# Altium schematic sheet DizCharger_atmega_ardunio_sheild.SchDoc: 18650 Arduino Capacity Tester
size A4; Date: 1-Jun-2020; Author: @ArakniD; CompanyName: HSBNE; DrawnBy: @ArakniD; Engineer: @ArakniD; Organization: 18650-R-US; Revision: 1; SheetNumber: 1; SheetTotal: 1; Time: 1:22 PM
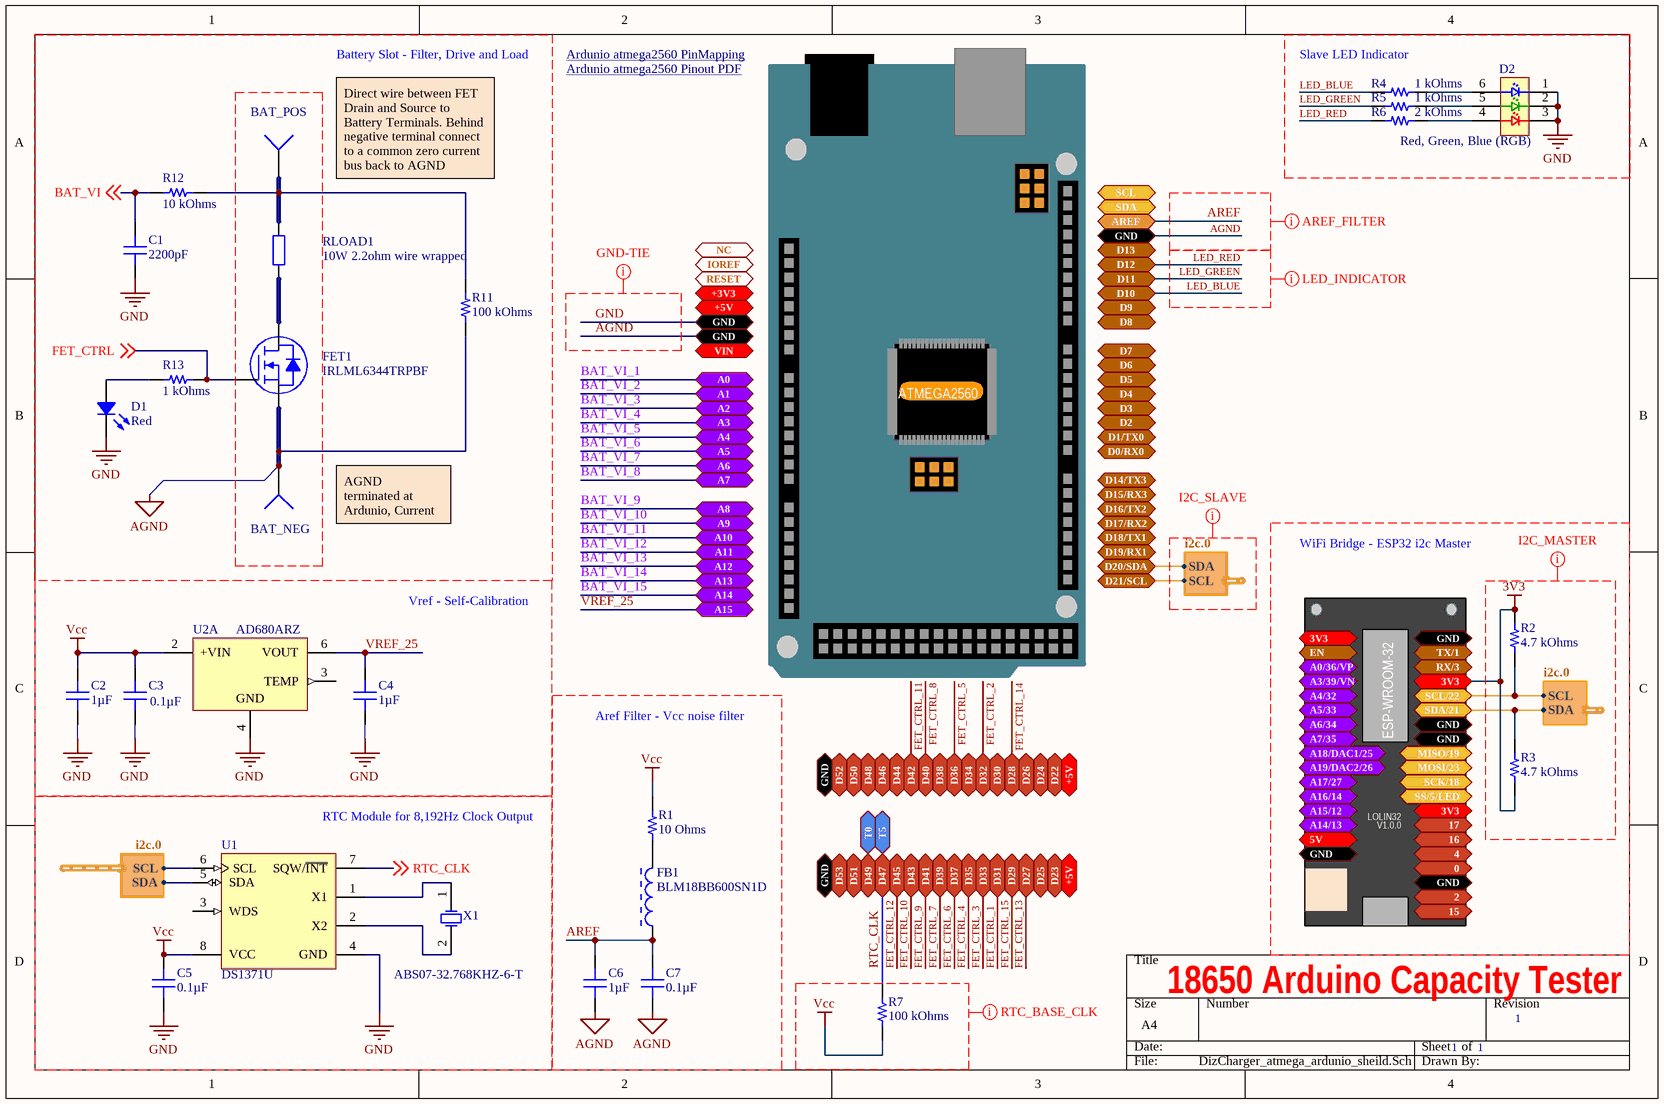
[diagram p0: DizCharger_atmega_ardunio_sheild.SchDoc]

## Parts
BAT_NEG  Socket  [PIN1]  (value not drawn)
BAT_POS  Socket  [PIN1]  (value not drawn)
C1  2200pF  [CAP 0805_2012]
C2  1µF  [CAP 0805_2012]
C3  0.1µF  [CAP 0805_2012]
C4  1µF  [CAP 0805_2012]
C5  0.1µF  [CAP 0805_2012]
C6  1µF  [CAP 0805_2012]
C7  0.1µF  [CAP 0805_2012]
D1  Red  [LED 1206_3216 RED]
D2  Red, Green, Blue (RGB)  [LED PLCC6-CREE 5.5X5.3MM]
FB1  BLM18BB600SN1D  [MURA-BLM18-F-H1-CHIP-2_V]
FET1  IRLML6344TRPBF  [INFINEON SOT-23-3]
R1  10 Ohms  [RES 0805_2012]
R2  4.7 kOhms  [RES 0805_2012]
R3  4.7 kOhms  [RES 0805_2012]
R4  1 kOhms  [RES 0805_2012]
R5  1 kOhms  [RES 0805_2012]
R6  2 kOhms  [RES 0805_2012]
R7  100 kOhms  [RES 0805_2012]
R11  100 kOhms  [RES 0805_2012]
R12  10 kOhms  [RES 0805_2012]
R13  1 kOhms  [RES 0805_2012]
RLOAD1  10W 2.2ohm wire wrapped  [AXIAL-0.4]
U1  DS1371U  [U8-1_L]
U2  AD680ARZ  [ADI-R-8_L]  (part A of 2)
X1  ABS07-32.768KHZ-6-T  [ABRA-ABS07_V]

## Ports
0 (bidir), 2 (bidir), 3V3 (bidir), 4 (bidir), 5V (bidir), 15 (bidir), 16 (bidir), 17 (bidir), +3V3 (bidir), +5V (bidir), A0 (bidir), A0/36/VP (bidir), A1 (bidir), A2 (bidir), A3 (bidir), A3/39/VN (bidir), A4 (bidir), A4/32 (bidir), A5 (bidir), A5/33 (bidir), A6 (bidir), A6/34 (bidir), A7 (bidir), A7/35 (bidir), A8 (bidir), A9 (bidir), A10 (bidir), A11 (bidir), A12 (bidir), A13 (bidir), A14 (bidir), A14/13 (bidir), A15 (bidir), A15/12 (bidir), A16/14 (bidir), A17/27 (bidir), A18/DAC1/25 (bidir), A19/DAC2/26 (bidir), AREF (bidir), D0/RX0 (bidir), D1/TX0 (bidir), D2 (bidir), D3 (bidir), D4 (bidir), D5 (bidir), D6 (bidir), D7 (bidir), D8 (bidir), D9 (bidir), D10 (bidir), D11 (bidir), D12 (bidir), D13 (bidir), D14/TX3 (bidir), D15/RX3 (bidir), D16/TX2 (bidir), D17/RX2 (bidir), D18/TX1 (bidir), D19/RX1 (bidir), D20/SDA (bidir), D21/SCL (bidir), D22 (bidir), D23 (bidir), D24 (bidir), D25 (bidir), D26 (bidir), D27 (bidir), D28 (bidir), D29 (bidir), D30 (bidir), D31 (bidir), D32 (bidir), D33 (bidir), D34 (bidir), D35 (bidir), D36 (bidir), D37 (bidir), D38 (bidir), D39 (bidir), D40 (bidir), D41 (bidir), D42 (bidir), D43 (bidir), D44 (bidir), D45 (bidir), D46 (bidir), D47 (bidir), D48 (bidir), D49 (bidir), D50 (bidir), D51 (bidir), D52 (bidir), D53 (bidir), EN (bidir), GND (bidir), IOREF (bidir), MISO/19 (bidir), MOSI/23 (bidir), NC (bidir), RESET (bidir), RX/3 (bidir), SCK/18 (bidir), SCL (bidir), SCL/22 (bidir), SDA (bidir), SDA/21 (bidir), SS/5/LED (bidir), T0 (bidir), T5 (bidir), TX/1 (bidir), VIN (bidir)

## Harnesses
i2c.0: SDA, SCL

## Nets
3V3: R2.2 R3.1 ; port 3V3
AGND: BAT_NEG.1 C1.1 C2.1 C3.1 C4.1 C5.1 C6.1 C7.1 D1.2 D2.1(C1) D2.2(C2) D2.3(C3) FET1.2(S) R11.1 U1.4(GND) U2.4(GND) ; port GND  [also labelled GND]
Vcc: C2.2 C3.2 C5.2 R1.2 R7.1 U1.8(VCC) U2.2(+VIN)
AREF: C6.2 C7.2 FB1.1 ; port AREF
BAT_VI: C1.2 R12.2 ; off-sheet BAT_VI
BAT_VI_1: port A0
BAT_VI_2: port A1
BAT_VI_3: port A2
BAT_VI_4: port A3
BAT_VI_5: port A4
BAT_VI_6: port A5
BAT_VI_7: port A6
BAT_VI_8: port A7
BAT_VI_9: port A8
BAT_VI_10: port A9
BAT_VI_11: port A10
BAT_VI_12: port A11
BAT_VI_13: port A12
BAT_VI_14: port A13
BAT_VI_15: port A14
D20/SDA: port D20/SDA, harness i2c.0.SDA
D21/SCL: port D21/SCL, harness i2c.0.SCL
D49: port D49, port T0
FET_CTRL: FET1.1(G) R13.1 ; off-sheet FET_CTRL
FET_CTRL_1: port D31
FET_CTRL_2: port D32
FET_CTRL_3: port D33
FET_CTRL_4: port D35
FET_CTRL_5: port D36
FET_CTRL_6: port D37
FET_CTRL_7: port D39
FET_CTRL_8: port D40
FET_CTRL_9: port D41
FET_CTRL_10: port D43
FET_CTRL_11: port D42
FET_CTRL_12: port D45
FET_CTRL_13: port D27
FET_CTRL_14: port D28
FET_CTRL_15: port D29
LED_BLUE: R4.2 ; port D10
LED_GREEN: R5.2 ; port D11
LED_RED: R6.1 ; port D12
RTC_CLK: R7.2 U1.7(SQW/~{INT}) ; off-sheet RTC_CLK, port D47, port T5
SCL/22: R2.1 ; port SCL/22, harness i2c.0.SCL
SDA/21: R3.2 ; port SDA/21, harness i2c.0.SDA
VREF_25: C4.2 U2.6(VOUT) ; port A15
NetBAT_POS_1: BAT_POS.1 R11.2 R12.1 RLOAD1.2
NetD1_1: D1.1 R13.2
NetD2_4: D2.4(A3) R6.2
NetD2_5: D2.5(A2) R5.1
NetD2_6: D2.6(A1) R4.1
NetFB1_2: FB1.2 R1.1
NetFET1_3: FET1.3(D) RLOAD1.1
NetU1_1: U1.1(X1) X1.1(X1)
NetU1_2: U1.2(X2) X1.2(X2)
NetU1_5: U1.5(SDA) ; harness i2c.0.SDA
NetU1_6: U1.6(SCL) ; harness i2c.0.SCL

Not connected (* = marked no-connect by the designer): U1 3(WDS); U2 3(TEMP)

## Layout directives
mark named GND-TIE: AGND, GND
mark named AREF_FILTER: AGND, AREF
mark named LED_INDICATOR: LED_BLUE, LED_GREEN, LED_RED
mark named I2C_SLAVE: (no net found under the mark)
mark named I2C_MASTER: 3V3
mark named RTC_BASE_CLK: Vcc

## Notes on the sheet
- Battery Slot - Filter, Drive and Load
- Ardunio atmega2560 PinMapping <https://www.arduino.cc/en/Hacking/PinMapping2560>
- Ardunio atmega2560 Pinout PDF <https://content.arduino.cc/assets/Pinout-Mega2560rev3_latest.pdf>
- Slave LED Indicator
- Direct wire between FET Drain and Source to Battery Terminals. Behind negative terminal connect to a common zero current bus back to AGND
- ATMEGA2560
- AGND  terminated at Ardunio, Current flow will induce false voltage/current readings
- WiFi Bridge - ESP32 i2c Master
- Vref - Self-Calibration
- ESP-WROOM-32
- Aref Filter - Vcc noise filter
- (near U1) RTC Module for 8,192Hz Clock Output
- #if defined(__AVR_ATmega1280__)
  { 30,31,32,33, 34,35,36,37, 43,42,45, 38,39,40,41  };
  #elif defined(__AVR_ATmega2560__)
  { 31,32,33, 35,36,37, 39,40,41, 43,42,45, 27,28,29 };
  #endif
- LOLIN32
- V1.0.0

## Library data of the parts
C1 = C0805C222KAGECAUTO: CAP CER 0805 2.2NF 250V C0G; Manufacturer: KEMET; Temperature Coefficient: C0G, NP0; Tolerance: ±10%; Part Number: C0805C222KAGECAUTO; Value: 2200pF; Applications: Automotive, ESD Protection; Capacitance: 2200pF; ComponentLink1Description: Datasheet; ComponentLink1URL: https://api.kemet.com/component-edge/download/datasheet/C0805C222KAGECAUTO.pdf; ComponentLink2Description: DigiKey Link; ComponentLink2URL: http://digikey.com/product-detail/en/kemet/C0805C222KAGECAUTO/399-17905-1-ND/8640572; Device Package: 0805 (2012 Metric); Features: Low ESL; LastUpdated: 21/01/2020 12:02:55 AM; Lifecycle Status: Active; Minimum Order: 1; Mounting Type: Surface Mount, MLCC; Operating Temperature: -55°C ~ 125°C; Package / Case: 0805 (2012 Metric); Packaging: TapeAndReel; PartId: 9908; Part Status: Active; Price: 0.05; Ratings: AEC-Q200; Series: ESD SMD Auto C0G; Size / Dimension: 0.079" L x 0.049" W (2.00mm x 1.25mm); Supplier 1: DigiKey; Supplier Part Number 1: 399-17905-1-ND; Thickness (Max): 0.035" (0.88mm); Voltage - Rated: 250V
C2 C4 C6 = 0805YC105KAZ2A: CAP CER 1UF 16V X7R 0805; Manufacturer: AVX Corporation; Tolerance: ±10%; Part Number: 0805YC105KAZ2A; Value: 1µF; Applications: Boardflex Sensitive; Capacitance: 1µF; ComponentLink1Description: Datasheet; ComponentLink1URL: http://datasheets.avx.com/FlexitermMLCC.pdf; ComponentLink2Description: DigiKey Link; ComponentLink2URL: http://digikey.com/product-detail/en/avx-corporation/0805YC105KAZ2A/478-11646-1-ND/8564204; Device Package: 0805 (2012 Metric); Features: Soft Termination; LastUpdated: 21/01/2020 12:02:58 AM; Lifecycle Status: Active; Minimum Order: 1; Mounting Type: Surface Mount, MLCC; Operating Temperature: -55°C ~ 125°C; Package / Case: 0805 (2012 Metric); Packaging: TapeAndReel; PartId: 7759; Part Status: Active; Price: 0.60; Series: FLEXITERM®; Size / Dimension: 0.079" L x 0.049" W (2.00mm x 1.25mm); Supplier 1: DigiKey; Supplier Part Number 1: 478-11646-1-ND; Temperature Coefficient: X7R; Thickness (Max): 0.037" (0.94mm); Voltage - Rated: 16V
C3 C5 C7 = 0805B104K160CT: CAP CER 0.1UF 16V X7R 0805; Manufacturer: Walsin Technology Corporation; Tolerance: ±10%; Part Number: 0805B104K160CT; Value: 0.1µF; Applications: General Purpose; Capacitance: 0.1µF; ComponentLink1Description: Datasheet; ComponentLink1URL: http://www.passivecomponent.com/wp-content/uploads/2018/10/MLCC.pdf; ComponentLink2Description: DigiKey Link; ComponentLink2URL: http://digikey.com/product-detail/en/walsin-technology-corporation/0805B104K160CT/1292-1565-1-ND/9355569; Device Package: 0805 (2012 Metric); LastUpdated: 21/01/2020 12:03:02 AM; Lifecycle Status: Active; Minimum Order: 1; Mounting Type: Surface Mount, MLCC; Operating Temperature: -55°C ~ 125°C; Package / Case: 0805 (2012 Metric); Packaging: TapeAndReel; PartId: 4882; Part Status: Active; Price: 0.02; Series: -; Size / Dimension: 0.079" L x 0.049" W (2.00mm x 1.25mm); Supplier 1: DigiKey; Supplier Part Number 1: 1292-1565-1-ND; Temperature Coefficient: X7R; Thickness (Max): 0.035" (0.90mm); Voltage - Rated: 16V
D1 = APTL3216SURCK-01: LED SMD; Manufacturer: Kingbright; Configuration: 1206; Current - Test: 20mA; Lens Color: Colorless; Lens Size: 1.10mm Dia; Lens Style: Round with Domed Top; Lens Transparency: Clear; Millicandela Rating: 230mcd; Viewing Angle: 80°; Voltage - Forward (Vf) (Typ): 1.95V; Wavelength - Dominant: 630nm; Wavelength - Peak: 645nm; Part Number: APTL3216SURCK-01; Color: Red; ComponentLink1Description: Datasheet; ComponentLink1URL: http://www.kingbrightusa.com/images/catalog/SPEC/APTL3216SURCK-01.pdf; ComponentLink2Description: DigiKey Link; ComponentLink2URL: http://digikey.com/product-detail/en/kingbright/APTL3216SURCK-01/754-APTL3216SURCK-01CT-ND/10293135; Device Package: 1206 (3216 Metric); Height (Max): 1.20mm; LastUpdated: 21/01/2020 3:14:28 AM; Lifecycle Status: Active; Minimum Order: 1; Mounting Type: Surface Mount; Package / Case: 1206 (3216 Metric); Packaging: TapeAndReel; PartId: 229; Part Status: Active; Price: 0.08; Series: Heli-R; Size / Dimension: 3.20mm L x 1.60mm W; Supplier 1: DigiKey; Supplier Part Number 1: 754-APTL3216SURCK-01CT-ND; Supplier Device Package: 1206; Value: Red
D2 = SLV6A-FKB-CK1P1G1BB7R3R3: LED RGB 6PLCC SMD; Manufacturer: Cree Inc.; Configuration: Independent; Current - Test: 20mA Red, 20mA Green, 20mA Blue; Lens Color: 2.60mm; Lens Size: 4.20mm Dia; Lens Style: Round with Flat Top; Millicandela Rating: 840mcd Red, 1680mcd Green, 420mcd Blue; Voltage - Forward (Vf) (Typ): 2V Red, 3.2V Green, 3.2V Blue; Wavelength - Dominant: 622nm Red, 530nm Green, 470nm Blue; Part Number: SLV6A-FKB-CK1P1G1BB7R3R3; Color: Red, Green, Blue (RGB); ComponentLink1Description: Datasheet; ComponentLink1URL: https://www.cree.com/led-components/media/documents/1320-SLV6A-FKB.pdf; ComponentLink2Description: DigiKey Link; ComponentLink2URL: http://digikey.com/product-detail/en/cree-inc/SLV6A-FKB-CK1P1G1BB7R3R3/SLV6A-FKB-CK1P1G1BB7R3R3CT-ND/6138648; Device Package: 6-SMD, J-Lead; Height (Max): 2.60mm; LastUpdated: 19/03/2020 10:22:30 PM; Lifecycle Status: Active; Minimum Order: 1; Mounting Type: Surface Mount; Package / Case: 6-SMD, J-Lead; Packaging: TapeAndReel; PartId: 954; Part Status: Active; Price: 0.33; Series: SLV6A-FKB; Size / Dimension: 5.50mm L x 5.30mm W; Supplier 1: DigiKey; Supplier Part Number 1: SLV6A-FKB-CK1P1G1BB7R3R3CT-ND; Supplier Device Package: 6-PLCC; Value: Red, Green, Blue (RGB)
FB1 = CMP-0686-00415-2: Chip Ferrite Bead for High-speed Signal Lines, 60 Ohm, 550 mA, -55 to 125 degC, 1.6 x 0.8 x 0.95 mm SMD, Tape and Reel; Manufacturer: Murata; DC Resistance: 0.25 Ohm Max.; Impedance (at 100 MHz): 60 Ohm +/- 25%; Rated Current: 550 mA; Operating Temperature Range: -55 to 125 degC; ComponentLink1Description: Manufacturer URL; Packing: Tape and Reel; DatasheetVersion: 08/2013; PackageReference: BLM18_H950-2; ComponentLink3Description: Package Specification; ComponentLink2URL: http://www.murata.com/products/catalog/pdf/c31e.pdf; ComponentLink2Description: Datasheet; Mounting Technology: Surface Mount; ComponentLink1URL: http://www.murata.com/; PartNumber: BLM18BB600SN1D; PackageDescription: 2-Pin Chip, Body 1.6 x 0.8 mm; ComponentLink3URL: http://www.murata.com/products/catalog/pdf/c31e.pdf
FET1 = IRLML6344TRPBF: MOSFET N-CH 30V 5A SOT23; Manufacturer: Infineon Technologies; Current - Continuous Drain (Id) @ 25°C: 5A (Ta); Drive Voltage (Max Rds On,  Min Rds On): 2.5V, 4.5V; FET Type: N-Channel; Gate Charge (Qg) (Max) @ Vgs: 6.8nC @ 4.5V; Input Capacitance (Ciss) (Max) @ Vds: 650pF @ 25V; Power Dissipation (Max): 1.3W (Ta); Rds On (Max) @ Id, Vgs: 29mOhm @ 5A, 4.5V; Vgs (Max): ±12V; Vgs(th) (Max) @ Id: 1.1V @ 10µA; Part Number: IRLML6344TRPBF; ComponentLink1Description: Datasheet; ComponentLink1URL: https://www.infineon.com/dgdl/irlml6344pbf.pdf?fileId=5546d462533600a4015356689c44262c; ComponentLink2Description: DigiKey Link; ComponentLink2URL: http://digikey.com/product-detail/en/infineon-technologies/IRLML6344TRPBF/IRLML6344TRPBFCT-ND/2538168; Device Package: TO-236-3, SC-59, SOT-23-3; Drain to Source Voltage (Vdss): 30V; LastUpdated: 21/01/2020 4:00:48 AM; Lifecycle Status: Active; Minimum Order: 1; Mounting Type: Surface Mount; Operating Temperature: -55°C ~ 150°C (TJ); Package / Case: TO-236-3, SC-59, SOT-23-3; Packaging: TapeAndReel; Part Status: Active; Price: 0.12; Series: HEXFET®; Supplier 1: DigiKey; Supplier Part Number 1: IRLML6344TRPBFCT-ND; Supplier Device Package: Micro3™/SOT-23; Technology: MOSFET (Metal Oxide)
R1 = Y407210R0000C9W: RES SMD 10 OHM 0.25% 1/5W 0805; Manufacturer: Vishay Foil Resistors (Division of Vishay Precision Group); Power (Watts): 0.2W, 1/5W; Temperature Coefficient: ±0.2ppm/°C; Part Number: Y407210R0000C9W; Value: 10 Ohms; ComponentLink1Description: Datasheet; ComponentLink1URL: http://www.vishaypg.com/docs/63237/FRFC.pdf; ComponentLink2Description: DigiKey Link; ComponentLink2URL: http://digikey.com/product-detail/en/vishay-foil-resistors-division-of-vishay-precision-group/Y407210R0000C9W/804-1211-ND/6026412; Composition: Metal Foil; Device Package: 0805 (2012 Metric); Features: Moisture Resistant, Non-Inductive; Height - Seated (Max): 0.025" (0.64mm); LastUpdated: 21/01/2020 1:44:08 AM; Lifecycle Status: Active; Minimum Order: 1; Number of Terminations: 2; Operating Temperature: -55°C ~ 150°C; Package / Case: 0805 (2012 Metric); Packaging: Tray; PartId: 41157; Part Status: Active; Price: 12.78; Resistance: 10 Ohms; Series: FRFC; Size / Dimension: 0.079" L x 0.049" W (2.01mm x 1.24mm); Supplier 1: DigiKey; Supplier Part Number 1: 804-1211-ND; Supplier Device Package: 0805; Tolerance: ±0.25%
R2 R3 = RCS08054K70FKEA: RES SMD 4.7K OHM 1% 0.4W 0805; Manufacturer: Vishay Dale; Power (Watts): 0.4W, 2/5W; Temperature Coefficient: ±100ppm/°C; Part Number: RCS08054K70FKEA; Value: 4.7 kOhms; ComponentLink1Description: Datasheet; ComponentLink1URL: http://www.vishay.com/docs/20065/rcse3.pdf; ComponentLink2Description: DigiKey Link; ComponentLink2URL: http://digikey.com/product-detail/en/vishay-dale/RCS08054K70FKEA/541-2842-1-ND/5867135; Composition: Thick Film; Device Package: 0805 (2012 Metric); Features: Automotive AEC-Q200, Pulse Withstanding; Height - Seated (Max): 0.020" (0.50mm); LastUpdated: 21/01/2020 1:46:53 AM; Lifecycle Status: Active; Minimum Order: 1; Number of Terminations: 2; Operating Temperature: -55°C ~ 155°C; Package / Case: 0805 (2012 Metric); Packaging: TapeAndReel; PartId: 34977; Part Status: Active; Price: 0.03; Ratings: AEC-Q200; Resistance: 4.7 kOhms; Series: AccliMate™ RCU; Size / Dimension: 0.079" L x 0.049" W (2.00mm x 1.25mm); Supplier 1: DigiKey; Supplier Part Number 1: 541-2842-1-ND; Supplier Device Package: 0805; Tolerance: ±1%
R4 R5 R13 = TNPW08051K00FEEA: RES 1K OHM 1% 1/5W 0805; Manufacturer: Vishay Dale; Power (Watts): 0.2W, 1/5W; Temperature Coefficient: ±25ppm/°C; Part Number: TNPW08051K00FEEA; Value: 1 kOhms; ComponentLink1Description: Datasheet; ComponentLink1URL: http://www.vishay.com/docs/28758/tnpw_e3.pdf; ComponentLink2Description: DigiKey Link; ComponentLink2URL: http://digikey.com/product-detail/en/vishay-dale/TNPW08051K00FEEA/541-3747-1-ND/7355107; Composition: Thin Film; Device Package: 0805 (2012 Metric); Features: Anti-Sulfur, Automotive AEC-Q200, Moisture Resistant; Height - Seated (Max): 0.022" (0.55mm); LastUpdated: 21/01/2020 1:45:19 AM; Lifecycle Status: Active; Minimum Order: 1; Number of Terminations: 2; Operating Temperature: -55°C ~ 155°C; Package / Case: 0805 (2012 Metric); Packaging: TapeAndReel; PartId: 38457; Part Status: Active; Price: 0.05; Ratings: AEC-Q200; Resistance: 1 kOhms; Series: TNPW e3; Size / Dimension: 0.079" L x 0.049" W (2.00mm x 1.25mm); Supplier 1: DigiKey; Supplier Part Number 1: 541-3747-1-ND; Supplier Device Package: 0805; Tolerance: ±1%
R6 = CR0805AFX-2001EAS: RESA-AS 0805 2K 1% 125MW TC100; Manufacturer: Bourns Inc.; Power (Watts): 0.125W, 1/8W; Temperature Coefficient: ±100ppm/°C; Part Number: CR0805AFX-2001EAS; Value: 2 kOhms; ComponentLink1Description: Datasheet; ComponentLink1URL: //media.digikey.com/pdf/Data%20Sheets/Bourns%20PDFs/CRyyyyA-AS_Model_DS.pdf; ComponentLink2Description: DigiKey Link; ComponentLink2URL: http://digikey.com/product-detail/en/bourns-inc/CR0805AFX-2001EAS/CR0805AFX-2001EASCT-ND/10240181; Composition: Thick Film; Device Package: 0805 (2012 Metric); Features: Anti-Sulfur, Automotive AEC-Q200, Moisture Resistant; Height - Seated (Max): 0.024" (0.60mm); LastUpdated: 21/01/2020 1:41:13 AM; Lifecycle Status: Active; Minimum Order: 1; Number of Terminations: 2; Operating Temperature: -55°C ~ 155°C; Package / Case: 0805 (2012 Metric); Packaging: TapeAndReel; PartId: 46960; Part Status: Active; Price: 0.01; Ratings: AEC-Q200; Resistance: 2 kOhms; Series: CR0805A-AS; Size / Dimension: 0.079" L x 0.049" W (2.00mm x 1.25mm); Supplier 1: DigiKey; Supplier Part Number 1: CR0805AFX-2001EASCT-ND; Supplier Device Package: 0805; Tolerance: ±1%
R7 R11 = TNPW0805100KFEEA: RES 100K OHM 1% 1/5W 0805; Manufacturer: Vishay Dale; Power (Watts): 0.2W, 1/5W; Temperature Coefficient: ±25ppm/°C; Part Number: TNPW0805100KFEEA; Value: 100 kOhms; ComponentLink1Description: Datasheet; ComponentLink1URL: http://www.vishay.com/docs/28758/tnpw_e3.pdf; ComponentLink2Description: DigiKey Link; ComponentLink2URL: http://digikey.com/product-detail/en/vishay-dale/TNPW0805100KFEEA/541-3912-1-ND/7355270; Composition: Thin Film; Device Package: 0805 (2012 Metric); Features: Anti-Sulfur, Automotive AEC-Q200, Moisture Resistant; Height - Seated (Max): 0.022" (0.55mm); LastUpdated: 21/01/2020 1:47:05 AM; Lifecycle Status: Active; Minimum Order: 1; Number of Terminations: 2; Operating Temperature: -55°C ~ 155°C; Package / Case: 0805 (2012 Metric); Packaging: TapeAndReel; PartId: 34552; Part Status: Active; Price: 0.05; Ratings: AEC-Q200; Resistance: 100 kOhms; Series: TNPW e3; Size / Dimension: 0.079" L x 0.049" W (2.00mm x 1.25mm); Supplier 1: DigiKey; Supplier Part Number 1: 541-3912-1-ND; Supplier Device Package: 0805; Tolerance: ±1%
R12 = Y162910K0000F9R: RES SMD 10K OHM 1% 1/10W 0805; Manufacturer: Vishay Foil Resistors (Division of Vishay Precision Group); Power (Watts): 0.1W, 1/10W; Temperature Coefficient: ±0.2ppm/°C; Part Number: Y162910K0000F9R; Value: 10 kOhms; ComponentLink1Description: Datasheet; ComponentLink1URL: http://www.vishaypg.com/docs/63106/VFCP.pdf; ComponentLink2Description: DigiKey Link; ComponentLink2URL: http://digikey.com/product-detail/en/vishay-foil-resistors-division-of-vishay-precision-group/Y162910K0000F9R/Y1629-10.0KECT-ND/4333513; Composition: Metal Foil; Device Package: 0805 (2012 Metric); Features: Anti-Sulfur, Moisture Resistant, Non-Inductive; Height - Seated (Max): 0.025" (0.64mm); LastUpdated: 21/01/2020 1:47:11 AM; Lifecycle Status: Active; Minimum Order: 1; Number of Terminations: 2; Operating Temperature: -55°C ~ 150°C; Package / Case: 0805 (2012 Metric); Packaging: TapeAndReel; PartId: 34447; Part Status: Active; Price: 6.13; Resistance: 10 kOhms; Series: VFCP; Size / Dimension: 0.079" L x 0.049" W (2.01mm x 1.24mm); Supplier 1: DigiKey; Supplier Part Number 1: Y1629-10.0KECT-ND; Supplier Device Package: 0805; Tolerance: ±1%
RLOAD1 = Res2: Resistor; Value: 2.2; Published: 8-Jun-2000; LatestRevisionDate: 17-Jul-2002; LatestRevisionNote: Re-released for DXP Platform.; PackageReference: AXIAL-0.4; Publisher: Altium Limited; PackageDescription: Axial Device, Thru-Hole; 2 Leads; 0.4 in Pin Spacing; Supplier 1: Digi-Key; Supplier Part Number 1: 40J2R2-ND
U1 = CMP-0254-00449-1: I2C, 32-bit Binary Counter Watchdog Real-Time Clock, 8-Pin uSOP, -40 to 85 degC; DatasheetVersion: 6-Jul-2007; ComponentLink1Description: Manufacturer URL; ComponentLink3Description: Package Specification; PackageDescription: 8-Pin Micro-MAX, Thin Shrink Small-Outline, 0.65 mm Pitch, uMAX, uSOP; ComponentLink3URL: http://pdfserv.maxim-ic.com/package_dwgs/21-0036.PDF; ComponentLink2Description: Datasheet; ComponentLink1URL: http://www.maxim-ic.com; PackageVersion: revL, 2009; ComponentLink2URL: http://datasheets.maxim-ic.com/en/ds/DS1371.pdf; Code_JEDEC: MO-187-AA; PackageReference: U8-1
U2 = CMP-0784-00263-1: Low Power, Low Cost Reference, 2.5 V Output, 4.5 to 36 V Supply, Industrial, 8-pin SOIC (R-8), Tube; Manufacturer: Analog Devices; Vout: 2.5V; Min V Supply (V): 4.5; Ref Out TC (ppm/C): 20; Max V Supply (V): 36; ComponentLink3Description: Package Specification; Mounting Technology: Surface Mount; PackageDescription: 8-Pin Standard Small Outline Package, Body 4.9 x 3.9 mm, Pitch 1.27 mm; Code_JEDEC: MS-012-AA; PackageReference: R-8; Packing: Tube; ComponentLink2Description: Datasheet; ComponentLink4URL: Product URL:http://www.analog.com/en/special-linear-functions/voltage-references/ad680/products/product.html; PartNumber: AD680ARZ; ComponentLink1URL: http://www.analog.com/en/index.html; ComponentLink1Description: Manufacturer URL; Operating Temp Range: -40 to 85 degC; ComponentLink4Description: URL Link1; PackageVersion: 060506-A, 06/2006; ComponentLink2URL: http://www.analog.com/static/imported-files/data_sheets/AD680.pdf; DatasheetVersion: Rev. H; ComponentLink3URL: http://www.analog.com/static/imported-files/packages/PKG_PDF/SOIC_Narrow%20(R)/R_8.pdf
X1 = CMP-2000-05735-1: Low Profile Crystal, 32.768 KHz, 6 pF, -40 to 85 degC, 2-Pin SMD, RoHS, Tape and Reel; Manufacturer: ABRACON; Tolerance: 20PPM; Case Height: 0.9mm; Case Length: 3.2mm; Load Capacitance: 6pF; ESR: 70kOhms; Case Width: 1.5mm; Value: ABS07; RoHS: Details; Operating Temperature Range: -40Cto+85C; Package Reference: ABS07; Package URL: http://www.abracon.com/Resonators/ABS07.pdf; Type: LowProfileCrystal; Termination Style: SMD/SMT; Datasheet Version: 07/2012; Package Description: 2-Pin Surface Mount Device, Body 3.2 x 1.5 mm; Manufacturer URL: http://www.abracon.com/; Packaging: Reel; Product Category: Crystals; Mounting Style: SMD/SMT; Brand: ABRACON; Series: ABS07; Factory Pack Quantity: 3000; Dimensions: 1.5mmWx3.2mmLx0.9mmH; Datasheet URL: https://datasheet.ciiva.com/15116/getdatasheetpartid-719871-15116767.pdf; Mounting Technology: SurfaceMount; Frequency: 32.768kHz; Package / Case: 3.2mmx1.5mmx0.9mm
BAT_NEG BAT_POS = Socket: LatestRevisionDate: 17-Jul-2002; LatestRevisionNote: Re-released for DXP Platform.; Publisher: Altium Limited